# EAGLE schematic clvHd (EAGLE 9.6.2)
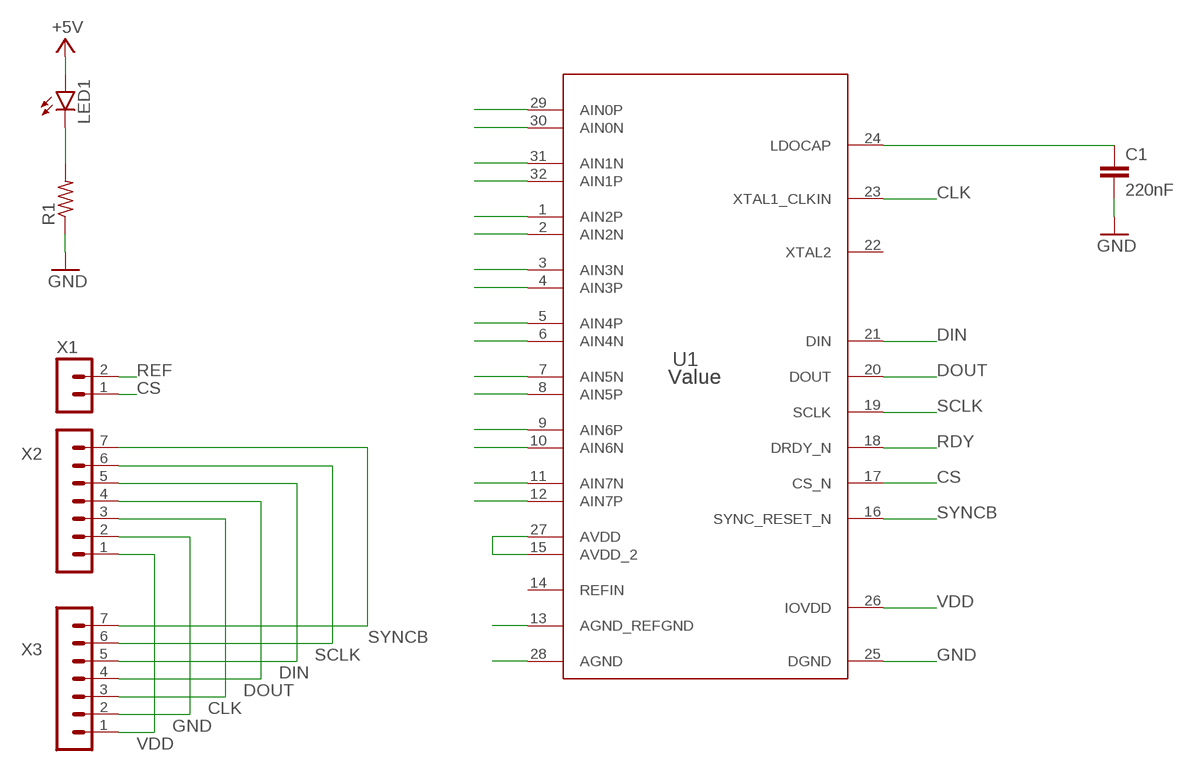
[diagram p0: schematic, sheet 1]

## Parts
C1  220nF  C-EUC0402  [C0402]
LED1  LEDCHIP-LED0603  [CHIP-LED0603]
R1  R-US_R0402  [R0402]
U1  Value  ADS131M08IPBS  [PBS0032A_N]
X1  BM02B-SRSS-TB  [BM02B-SRSS-TB]
X2  BM07B-SRSS-TB  [BM07B-SRSS-TB]
X3  BM07B-SRSS-TB  [BM07B-SRSS-TB]

## Nets
+5V: LED1.A
CLK: U1.23(XTAL1_CLKIN) X2.3 X3.3
CS: U1.17(CS_N) X1.1
DIN: U1.21(DIN) X2.5 X3.5
DOUT: U1.20(DOUT) X2.4 X3.4
GND: C1.2 R1.1 U1.25(DGND) X2.2 X3.2
INN0: U1.30(AIN0N)
INN1: U1.31(AIN1N)
INN2: U1.2(AIN2N)
INN3: U1.3(AIN3N)
INN4: U1.6(AIN4N)
INN5: U1.7(AIN5N)
INN6: U1.10(AIN6N)
INN7: U1.11(AIN7N)
INP0: U1.29(AIN0P)
INP1: U1.32(AIN1P)
INP2: U1.1(AIN2P)
INP3: U1.4(AIN3P)
INP4: U1.5(AIN4P)
INP5: U1.8(AIN5P)
INP6: U1.9(AIN6P)
INP7: U1.12(AIN7P)
N$1: LED1.C R1.2
N$2: C1.1 U1.24(LDOCAP)
N$4: U1.13(AGND_REFGND)
N$5: U1.28(AGND)
N$6: U1.15(AVDD_2) U1.27(AVDD)
RDY: U1.18(DRDY_N)
REF: X1.2
SCLK: U1.19(SCLK) X2.6 X3.6
SYNCB: U1.16(SYNC_RESET_N) X2.7 X3.7
VDD: U1.26(IOVDD) X2.1 X3.1
Unconnected: U1.14(REFIN) U1.22(XTAL2)

## Library data of the parts
C1 = rcl:C-EU: CAPACITOR, European symbol; SPICEPREFIX: C
LED1 = led:LED: LED OSRAM: - CHIPLED LG R971, LG N971, LY N971, LG Q971, LY Q971, LO R971, LY R971 LH N974, LH R974 LS Q976, LO Q976, LY Q976 LO Q996 - Hyper CHIPLED LW Q18S LB Q993, LB Q99A, LB R99A - SideLED LS A670, LO A670, LY A670, LG A670, LP A670 LB A673, LV A673, LT A673, LW A673 LH A674 LY A675 LS A676, LA A676, LO A676, LY A676, LW A676 LS A679, LY A679, LG A679 - Hyper Micro SIDELED® LS Y876, LA Y876, LO Y876, LY Y876 LT Y87S - SmartLED LW L88C, LW L88S LB L89C, LB L89S, LG L890 LS L89K, LO L89K, LY L89K LS L896, LA L896, LO L896, LY L896 - TOPLED LS T670, LO T670, LY T670, LG T670, LP T670 LSG T670, LSP T670, LSY T670, LOP T670, LYG T670 LG T671, LOG T671, LSG T671 LB T673, LV T673, LT T673, LW T673 LH T674 LS T676, LA T676, LO T676, LY T676, LB T676, LH T676, LSB T676, LW T676 LB T67C, LV T67C, LT T67C, LS T67K, LO T67K, LY T67K, LW E67C LS E67B, LA E67B, LO E67B, LY E67B, LB E67C, LV E67C, LT E67C LW T67C LS T679, LY T679, LG T679 LS T770, LO T770, LY T770, LG T770, LP T770 LB T773, LV T773, LT T773, LW T773 LH T774 LS E675, LA E675, LY E675, LS T675 LS T776, LA T776, LO T776, LY T776, LB T776 LHGB T686 LT T68C, LB T68C - Hyper Mini TOPLED® LB M676 - Mini TOPLED Santana® LG M470 LS M47K, LO M47K, LY M47K Source: http://www.osram.convergy.de LUXEON: - LUMILED® LXK2-PW12-R00, LXK2-PW12-S00, LXK2-PW14-U00, LXK2-PW14-V00 LXK2-PM12-R00, LXK2-PM12-S00, LXK2-PM14-U00 LXK2-PE12-Q00, LXK2-PE12-R00, LXK2-PE12-S00, LXK2-PE14-T00, LXK2-PE14-U00 LXK2-PB12-K00, LXK2-PB12-L00, LXK2-PB12-M00, LXK2-PB14-N00, LXK2-PB14-P00, LXK2-PB14-Q00 LXK2-PR12-L00, LXK2-PR12-M00, LXK2-PR14-Q00, LXK2-PR14-R00 LXK2-PD12-Q00, LXK2-PD12-R00, LXK2-PD12-S00 LXK2-PH12-R00, LXK2-PH12-S00 LXK2-PL12-P00, LXK2-PL12-Q00, LXK2-PL12-R00 Source: www.luxeon.com KINGBRIGHT: KA-3528ASYC Source: www.kingbright.com
R1 = rcl:R-US_: RESISTOR, American symbol; SPICEPREFIX: R
U1 = ADS:ADS131M08IPBS; MANUFACTURER: Texas Instruments; PARTNUMBER: ADS131M08IPBSR; REFDES: RefDes; TYPE: TYPE
X1 = con-JST SH:BM02B-SRSS: JST SH series header 1.00mm pitch disconnectable crimp style connectors, vertical (side entry type), 2 pins
X2 X3 = con-JST SH:BM07B-SRSS: JST SH series header 1.00mm pitch disconnectable crimp style connectors, vertical (side entry type), 7 pins